# Altium project ifly watch.PrjPcb
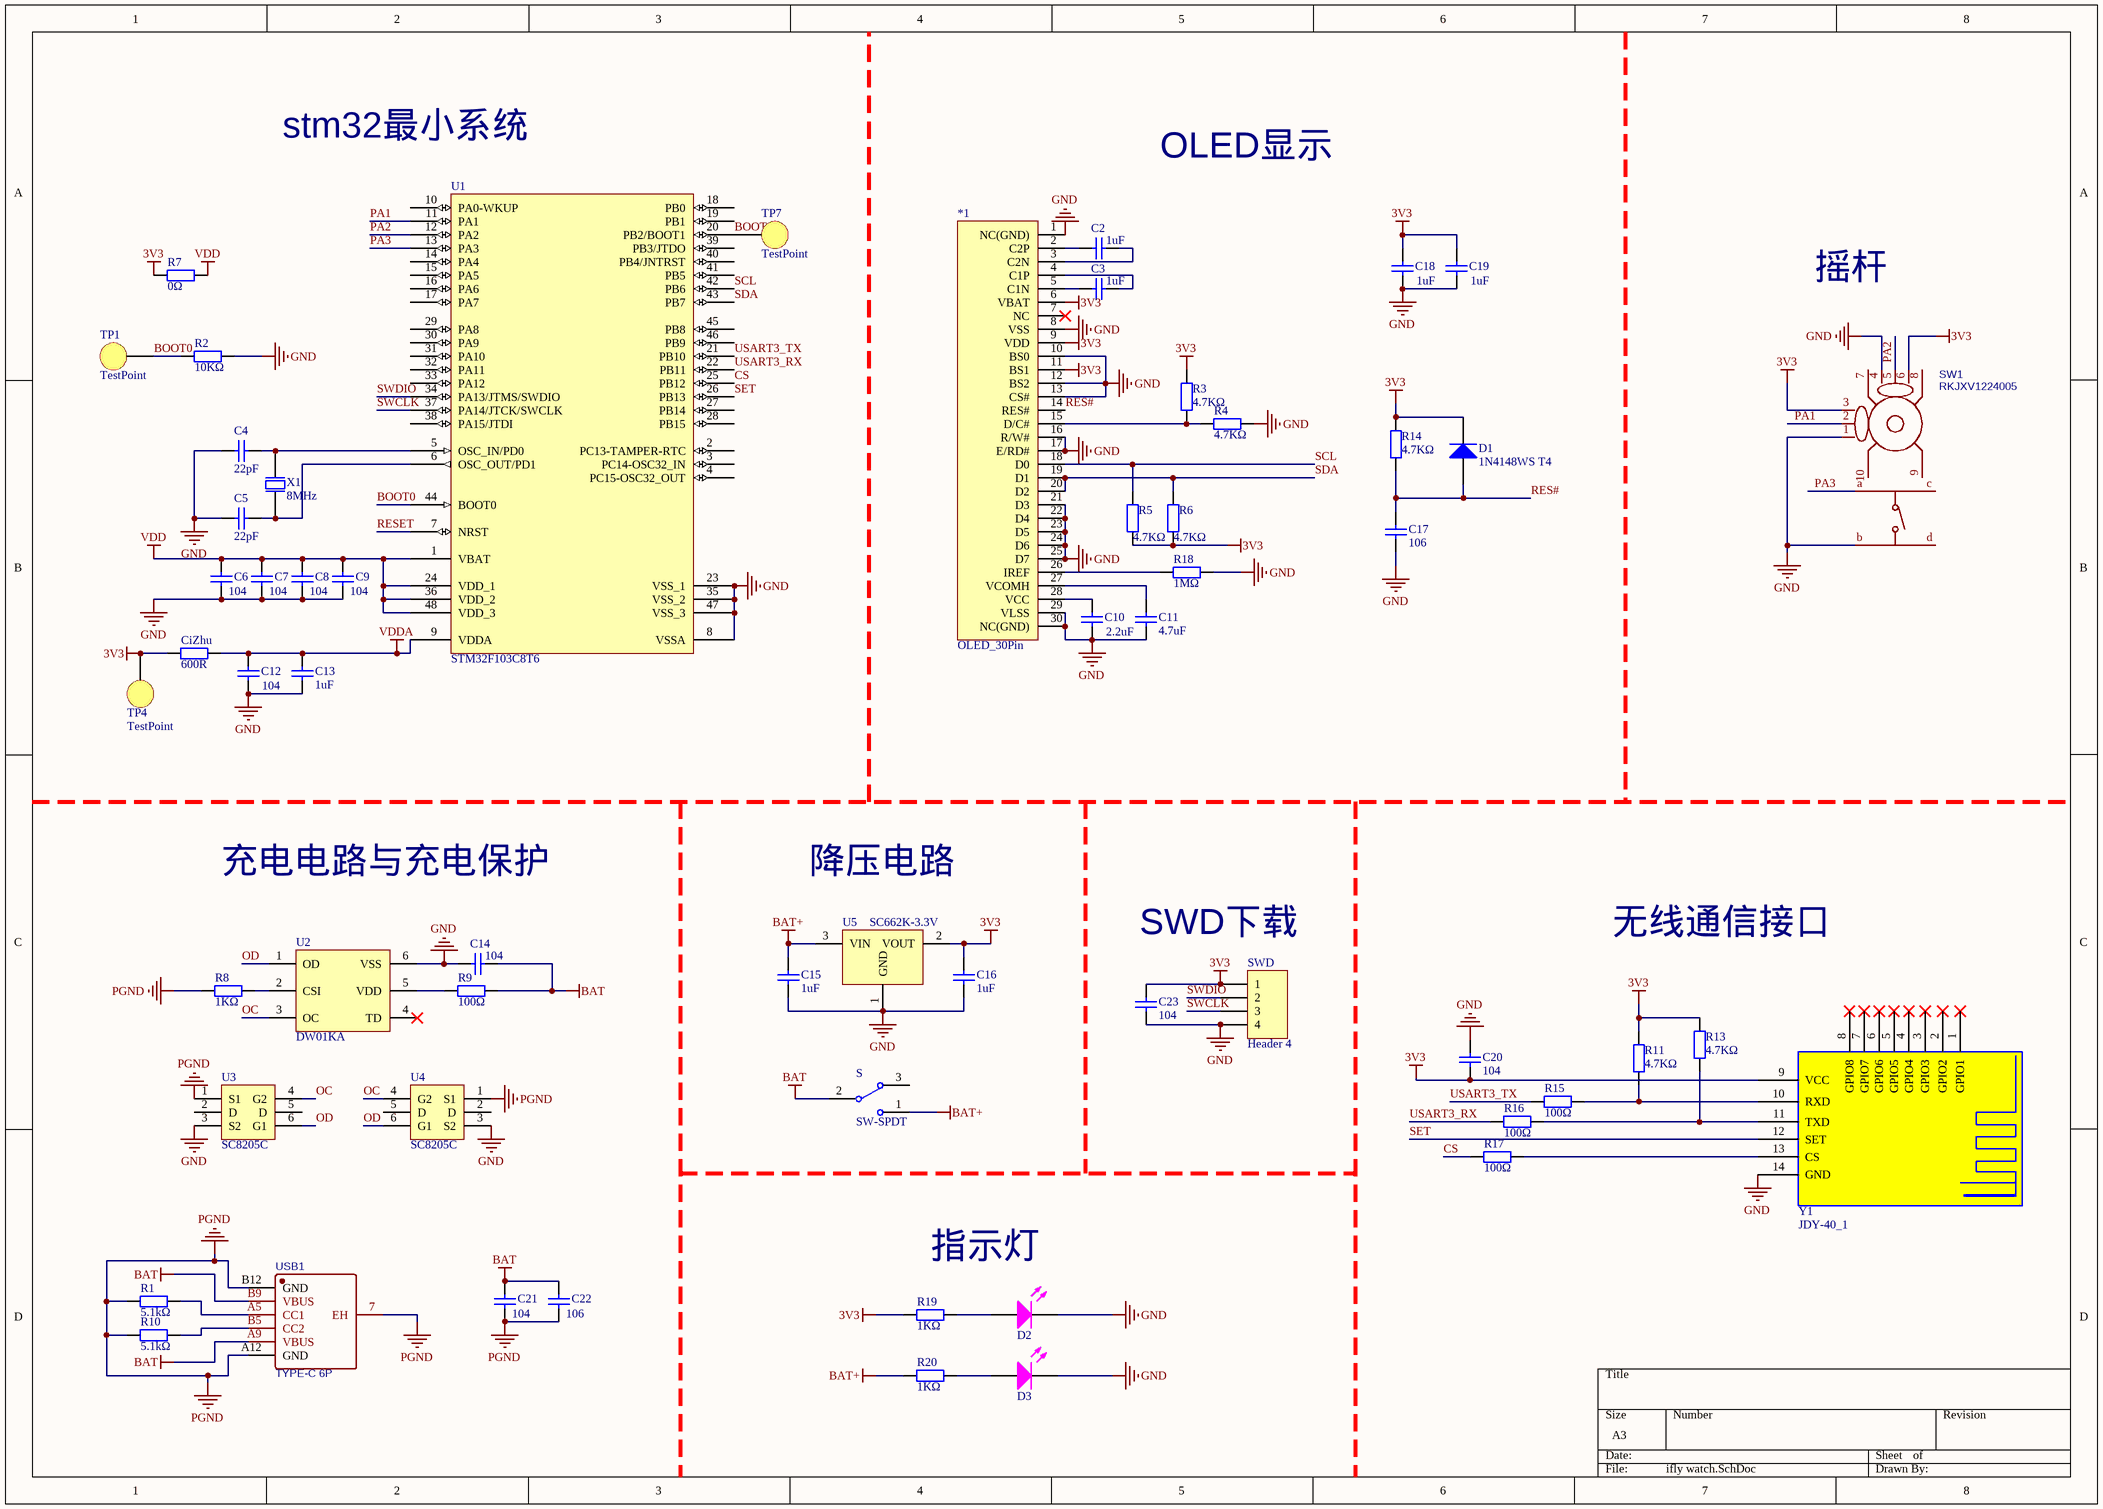
[diagram p0: ifly watch.SchDoc]
1 sheet, 60 parts. Net scope: global (net labels, ports and power ports of the same name join across sheets).
Board files: ifly watch_v1.PcbDoc, ifly watch_v2.PcbDoc

## Sheet ifly watch.SchDoc
size A3

### Parts
*1  OLED_30Pin  [OLED_0.96-30P-P0.70-12864]
C2  1uF  [LC-0603_C]
C3  1uF  [LC-0603_C]
C4  value 22pF  [C0603]  (hidden comment: 20pf)
C5  22pF  [C0603]
C6  104  [LC-0603_C]
C7  104  [LC-0603_C]
C8  104  [LC-0603_C]
C9  104  [LC-0603_C]
C10  2.2uF  [LC-0603_C]
C11  4.7uF  [LC-0603_C]
C12  104  [LC-0603_C]
C13  1uF  [LC-0603_C]
C14  104  [LC-0603_C]
C15  1uF  [LC-0603_C]
C16  1uF  [LC-0603_C]
C17  106  [LC-0603_C]
C18  1uF  [LC-0603_C]
C19  1uF  [LC-0603_C]
C20  104  [LC-0603_C]
C21  104  [LC-0603_C]
C22  106  [LC-0603_C]
C23  104  [LC-0603_C]
CiZhu  600R  [0603_R]
D1  1N4148WS T4  [LC-SOD-323]
D2  0603  [LED0603 R]  (value not drawn)
D3  0603  [LED0603 R]  (value not drawn)
R1  5.1kΩ  [LC-0603_R]
R2  10KΩ  [LC-0603_R]
R3  4.7KΩ  [LC-0603_R]
R4  4.7KΩ  [LC-0603_R]
R5  4.7KΩ  [LC-0603_R]
R6  4.7KΩ  [LC-0603_R]
R7  0Ω  [LC-0603_R]
R8  1KΩ  [LC-0603_R]
R9  100Ω  [LC-0603_R]
R10  5.1kΩ  [LC-0603_R]
R11  4.7KΩ  [LC-0603_R]
R13  4.7KΩ  [LC-0603_R]
R14  4.7KΩ  [LC-0603_R]
R15  100Ω  [LC-0603_R]
R16  100Ω  [LC-0603_R]
R17  100Ω  [LC-0603_R]
R18  1MΩ  [LC-0603_R]
R19  1KΩ  [LC-0603_R]
R20  1KΩ  [LC-0603_R]
S  SW-SPDT  [8.5*3.5_3P]
SW1  RKJXV1224005  [RKJXV1224005]
SWD  Header 4  [HDR1X4]
TP1  TestPoint  [TestPoint]
TP4  TestPoint  [TestPoint]
TP7  TestPoint  [TestPoint]
U1  STM32F103C8T6  [LC-LQFP-48_7x7x05P]
U2  DW01KA  [SOT-23-6]
U3  SC8205C  [SOT-23-6]
U4  SC8205C  [SOT-23-6]
U5  SC662K-3.3V  [SOT-23-3L]
USB1  TYPE-C 6P  [TYPE-C-SMD_TYPE-C-6P]
X1  Frequency: 8MHz  [SMD5032-2]  (hidden comment: 5032)
Y1  JDY-40_1  [JDY-401 -No via]

### Nets
3V3: *1.6(VBAT) *1.9(VDD) *1.11(BS1) C16.2 C18.2 C19.2 C20.2 C23.2 CiZhu.1 D1.2(K) R3.2 R5.1 R6.1 R7.2 R11.1 R13.1 R14.2 R19.1 SW1.3(A) SW1.6(B) SWD.1 TP4.1(TestPoint) U5.2(VOUT) Y1.9(VCC)
BAT: C14.1 C21.1 C22.2 R9.2 S.2 USB1.A9(VBUS) USB1.B9(VBUS)
BAT+: C15.2 R20.1 S.1 U5.3(VIN)
GND: *1.1(NC(GND)) *1.8(VSS) *1.10(BS0) *1.12(BS2) *1.13(CS#) *1.16(R/W#) *1.17(E/RD#) *1.21(D3) *1.22(D4) *1.23(D5) *1.24(D6) *1.25(D7) *1.29(VLSS) *1.30(NC(GND)) C4.1 C5.1 C6.1 C7.1 C8.1 C9.1 C10.1 C11.1 C12.1 C13.1 C14.2 C15.1 C16.1 C17.1 C18.1 C19.1 C20.1 C23.1 D2.2(K) D3.2(K) R2.1 R4.1 R18.2 SW1.1(B) SW1.4(A) SW1.b SWD.4 U1.8(VSSA) U1.23(VSS_1) U1.35(VSS_2) U1.47(VSS_3) U2.6(VSS) U3.3(S2) U4.3(S2) U5.1(GND) Y1.14(GND)
PGND: C21.2 C22.1 R1.1 R8.1 R10.1 U3.1(S1) U4.1(S1) USB1.7(EH) USB1.A12(GND) USB1.B12(GND)
VDD: C6.2 C7.2 C8.2 C9.2 R7.1 U1.1(VBAT) U1.24(VDD_1) U1.36(VDD_2) U1.48(VDD_3)
VDDA: C12.2 C13.2 CiZhu.2 U1.9(VDDA)
BOOT0: R2.2 TP1.1(TestPoint) U1.44(BOOT0)
BOOT1: TP7.1(TestPoint) U1.20(PB2/BOOT1)
CS: R17.1 U1.25(PB12)
OC: U2.3(OC) U3.4(G2) U4.4(G2)
OD: U2.1(OD) U3.6(G1) U4.6(G1)
PA1: SW1.2(DTA) U1.11(PA1)
PA2: SW1.5(DTA) U1.12(PA2)
PA3: SW1.a U1.13(PA3)
RES#: *1.14(RES#) C17.2 D1.1(A) R14.1
RESET: U1.7(NRST)
SCL: *1.18(D0) R5.2 U1.42(PB6)
SDA: *1.19(D1) *1.20(D2) R6.2 U1.43(PB7)
SET: U1.26(PB13) Y1.12(SET)
SWCLK: SWD.3 U1.37(PA14/JTCK/SWCLK)
SWDIO: SWD.2 U1.34(PA13/JTMS/SWDIO)
USART3_RX: R16.1 U1.22(PB11)
USART3_TX: R15.1 U1.21(PB10)
Net*1_2: *1.2(C2P) C2.2
Net*1_3: *1.3(C2N) C2.1
Net*1_4: *1.4(C1P) C3.1
Net*1_5: *1.5(C1N) C3.2
Net*1_15: *1.15(D/C#) R3.1 R4.2
Net*1_26: *1.26(IREF) R18.1
Net*1_27: *1.27(VCOMH) C11.2
Net*1_28: *1.28(VCC) C10.2
NetC4_2: C4.2 U1.5(OSC_IN/PD0) X1.2(OSC2)
NetC5_2: C5.2 U1.6(OSC_OUT/PD1) X1.1(OSC1)
NetD2_1: D2.1(A) R19.2
NetD3_1: D3.1(A) R20.2
NetR1_2: R1.2 USB1.A5(CC1)
NetR8_2: R8.2 U2.2(CSI)
NetR9_1: R9.1 U2.5(VDD)
NetR10_2: R10.2 USB1.B5(CC2)
NetR11_2: R11.2 R15.2 Y1.10(RXD)
NetR13_2: R13.2 R16.2 Y1.11(TXD)
NetR17_2: R17.2 Y1.13(CS)

Not connected (* = marked no-connect by the designer): *1 7(NC)*; S 3; SW1 7(GND) 8(GND) 9(GND) 10(GND) c d; U1 2(PC13-TAMPER-RTC) 3(PC14-OSC32_IN) 4(PC15-OSC32_OUT) 10(PA0-WKUP) 14(PA4) 15(PA5) 16(PA6) 17(PA7) 18(PB0) 19(PB1) 27(PB14) 28(PB15) 29(PA8) 30(PA9) 31(PA10) 32(PA11) 33(PA12) 38(PA15/JTDI) 39(PB3/JTDO) 40(PB4/JNTRST) 41(PB5) 45(PB8) 46(PB9); U2 4(TD)*; U3 2(D) 5(D); U4 2(D) 5(D); Y1 1(GPIO1)* 2(GPIO2)* 3(GPIO3)* 4(GPIO4)* 5(GPIO5)* 6(GPIO6)* 7(GPIO7)* 8(GPIO8)*

### Notes on the sheet
- stm32最小系统
- OLED显示
- 摇杆
- 充电电路与充电保护
- 降压电路
- SWD下载
- 无线通信接口
- 指示灯

### Library data of the parts
C2 C3 C13 C15 C16 C18 C19 C22 = 0603 1uF (105) 10% 50V: 贴片电容; ComponentLink1Description: 供应商链接; ComponentLink1URL: http://www.szlcsc.com/product/details_16531.html; Package: 0603; Supplier: LC; SuppliersPartNumber: C15849
C4 C5 = Cap Chip 0805: Polarized Capacitor (Radial); Published: 8-Jun-2000; Revision: July-2002: Re-released for DXP Platform.; Publisher: Altium Limited
  C5: Value: 22pF
C6-C9 C12 C14 C20 C21 = 0603 100nF (104) 10% 50V: 贴片电容; ComponentLink1Description: 供应商链接; ComponentLink1URL: http://www.szlcsc.com/product/details_15331.html; Package: 0603; Supplier: LC; SuppliersPartNumber: C14663
C10 = 0603 2.2uF (225) 10% 16V: 贴片电容; ComponentLink1Description: 供应商链接; ComponentLink1URL: http://www.szlcsc.com/product/details_24366.html; Package: 0603; Supplier: LC; SuppliersPartNumber: C23630
C11 = 0603 4.7uF (475) 10% 16V: 贴片电容; ComponentLink1Description: 供应商链接; ComponentLink1URL: http://www.szlcsc.com/product/details_20375.html; Package: 0603; Supplier: LC; SuppliersPartNumber: C19666
C17 = 0603 10uF (106) 10% 10V: 贴片电容; ComponentLink1Description: 供应商链接; ComponentLink1URL: http://www.szlcsc.com/product/details_20411.html; Package: 0603; Supplier: LC; SuppliersPartNumber: C19702
C23 = Cap Chip 0603: Polarized Capacitor (Radial); Published: 8-Jun-2000; Revision: July-2002: Re-released for DXP Platform.; Publisher: Altium Limited; Value: 104
CiZhu = Cizhu: 电阻_磁珠; value: ?
D1 = SOD-323 1N4148WS T4: 二极管; ComponentLink1Description: 供应商链接; ComponentLink1URL: http://www.szlcsc.com/product/details_2485.html; Package: SOD-323; Supplier: LC; SuppliersPartNumber: C2128
D2 D3 = LED-3-R: Typical INFRARED GaAs LED; Published: 8-Jun-2000; Revision: July-2002: Re-released for DXP Platform.; Publisher: Altium Limited
R1 R9 R10 R15-R17 = 0603 100Ω (1000) 1%: 贴片电阻; ComponentLink1Description: 供应商链接; ComponentLink1URL: http://www.szlcsc.com/product/details_23502.html; Package: 0603; Supplier: LC; SuppliersPartNumber: C22775
R2 = 0603 10KΩ (1002) 1%: 贴片电阻; ComponentLink1Description: 供应商链接; ComponentLink1URL: http://www.szlcsc.com/product/details_26547.html; Package: 0603; Supplier: LC; SuppliersPartNumber: C25804
R3-R6 R11 R13 R14 = 0603 4.7KΩ (4701) 1%: 贴片电阻; ComponentLink1Description: 供应商链接; ComponentLink1URL: http://www.szlcsc.com/product/details_23889.html; Package: 0603; Supplier: LC; SuppliersPartNumber: C23162
R7 = 0603 0Ω (0R0) 1%: 贴片电阻; ComponentLink1Description: 供应商链接; ComponentLink1URL: http://www.szlcsc.com/product/details_21903.html; Package: 0603; Supplier: LC; SuppliersPartNumber: C21189
R8 R19 R20 = 0603 1KΩ (1001) 1%: 贴片电阻; ComponentLink1Description: 供应商链接; ComponentLink1URL: http://www.szlcsc.com/product/details_21904.html; Package: 0603; Supplier: LC; SuppliersPartNumber: C21190
R18 = 0603 1MΩ (1004) 1%: 贴片电阻; ComponentLink1Description: 供应商链接; ComponentLink1URL: http://www.szlcsc.com/product/details_23662.html; Package: 0603; Supplier: LC; SuppliersPartNumber: C22935
S = SW-SPDT: SPDT Subminiature Toggle Switch, Right Angle Mounting, Vertical Actuation; Revision 1: Jul-2002: Re-released for DXP Platform.; Revision 2: 17-Dec-2003: Schematic revised, PCB Footprint replaced.; Published: 24-Mar-1999; Datasheet: Latest Revision: 05-Dec-2000; Publisher: Altium Limited
SW1 = RKJXV1224005: BOM_Manufacturer: ALPS Electric; Contributor: LCSC; BOM_Supplier: LCSC; BOM_Supplier Part: C146170; BOM_Manufacturer Part: RKJXV1224005; BOM_JLCPCB Part Class: Extended Part; spicePre: S; spiceSymbolName: RKJXV1224005
SWD = Header 4: Header, 4-Pin; LatestRevisionDate: 17-Jul-2002; LatestRevisionNote: Re-released for DXP Platform.; Publisher: Altium Limited
U1 = STM32F103C8T6: STM32 ARM-based 32-bit MCU with 64 Kbytes Flash, 48-pin LQFP, Industrial Temperature; Published: *; DatasheetVersion: *; PackageVersion: *; PackageReference: *; Publisher: *; PackageDescription: *; ComponentLink1Description: *; ComponentLink1URL: *; ComponentLink2Description: *; ComponentLink2URL: *
U2 = DW01KA: 锂电池保护芯片
U3 U4 = SC8205C: 二合一MOS
U5 = SC662K-3.3V: LDO
USB1 = TYPE-C 6P: BOM_Manufacturer: SHOU HAN; Contributor: LCSC; BOM_Supplier: LCSC; BOM_Supplier Part: C456012; BOM_Manufacturer Part: TYPE-C 6P; BOM_JLCPCB Part Class: Extended Part; spicePre: U; spiceSymbolName: TYPE-C 6P
X1 = XTAL: Crystal Oscillator; Published: 8-Jun-2000; Revision: July-2002: Re-released for DXP Platform.; Publisher: Altium Limited
Y1 = JDY-40_1: 串口透传无过孔